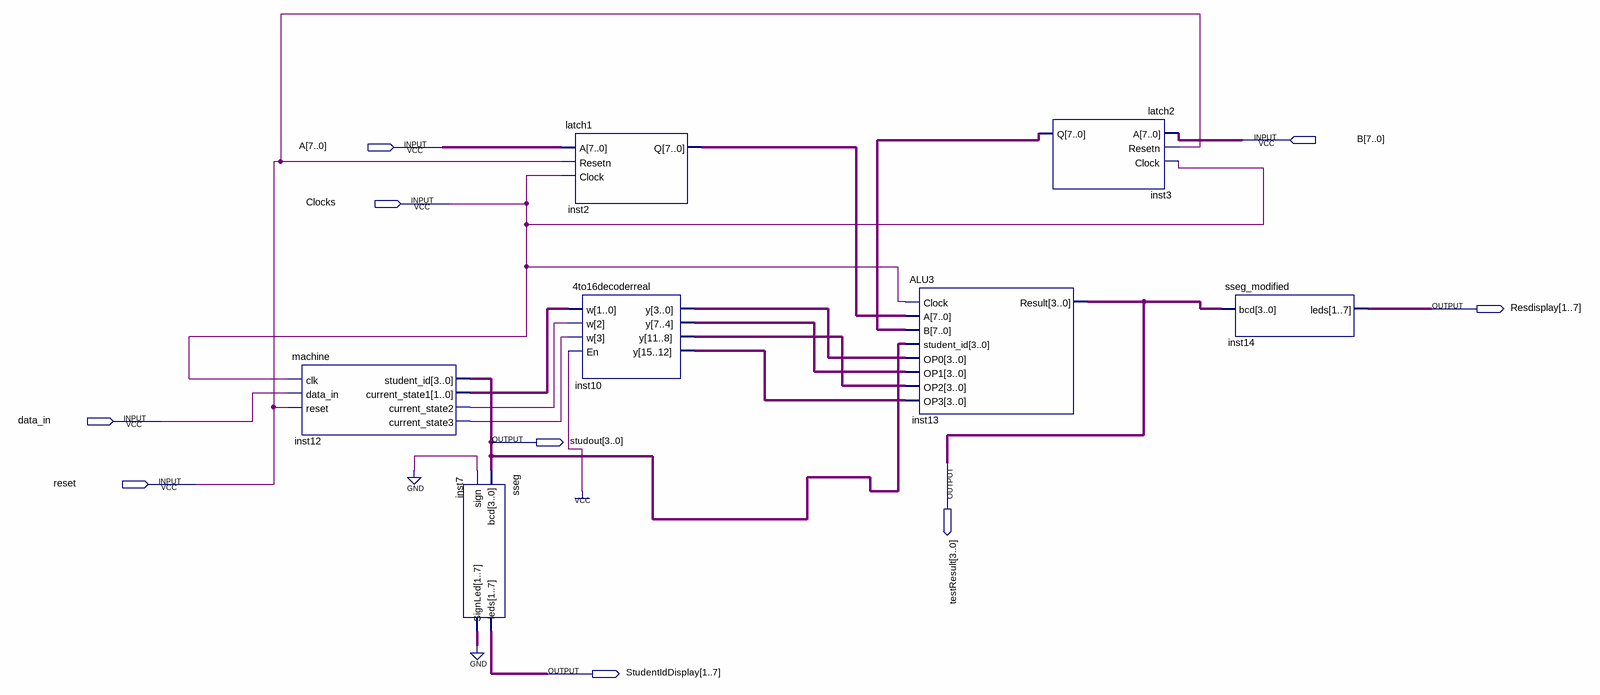
[diagram p0: schematic sheet]
// Quartus schematic ThirdALUDiag.bdf as structural Verilog: 7 symbols, 9 pins
module ThirdALUDiag (
  input  [7:0] B,
  input  [7:0] A,
  input  Clocks,
  input  data_in,
  input  reset,
  output [1:7] Resdisplay,
  output [3:0] studout,
  output [3:0] testResult,
  output [1:7] StudentIdDisplay
);

  wire inst12_current_state2, inst12_current_state3;
  wire [1:0] inst12_current_state1;
  wire [3:0] inst10_y, inst10_y_2, inst10_y_3, inst10_y_4;
  wire [6:0] inst7_signled;
  wire [7:0] inst2_q, inst3_q;

  machine inst12 (
    .clk(Clocks), .data_in(data_in), .reset(reset), .student_id(studout),
    .current_state1(inst12_current_state1), .current_state2(inst12_current_state2),
    .current_state3(inst12_current_state3));
  sseg inst7 (.bcd(studout), .sign(1'b0), .leds(StudentIdDisplay), .SignLed(inst7_signled));
  latch1 inst2 (.A(A), .Resetn(reset), .Clock(Clocks), .Q(inst2_q));
  \4to16decoderreal  inst10 (
    .w({inst12_current_state3, inst12_current_state2, inst12_current_state1}), .En(1'b1),
    .y({inst10_y_2, inst10_y_4, inst10_y, inst10_y_3}));
  ALU3 inst13 (
    .Clock(Clocks), .A(inst2_q), .B(inst3_q), .student_id(studout), .OP0(inst10_y_3), .OP1(inst10_y),
    .OP2(inst10_y_4), .OP3(inst10_y_2), .Result(testResult));
  latch2 inst3 (.A(B), .Resetn(reset), .Clock(Clocks), .Q(inst3_q));
  sseg_modified inst14 (.bcd(testResult), .leds(Resdisplay));
  // also tied to GND on the sheet: {inst7_signled[0], inst7_signled[1], inst7_signled[2], inst7_signled[3], inst7_signled[4], inst7_signled[5], inst7_signled[6]}
endmodule
